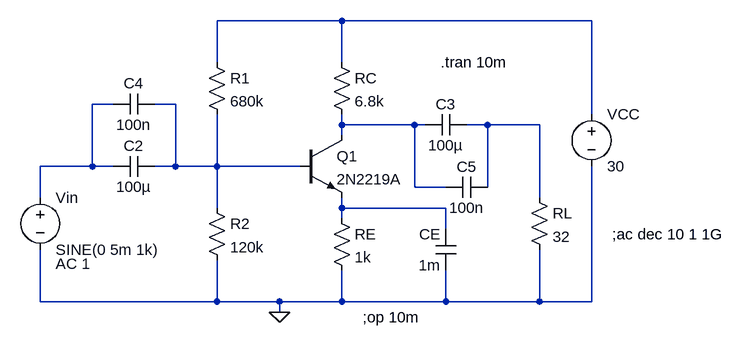
[diagram p0: schematic Circuit 2.asc]
Circuit 2.asc, the LTspice schematic file:
Version 4
SHEET 1 1024 680
WIRE 432 64 240 64
WIRE 816 64 432 64
WIRE 240 128 240 64
WIRE 432 128 432 64
WIRE 80 192 48 192
WIRE 176 192 144 192
WIRE 816 208 816 64
WIRE 432 224 432 208
WIRE 544 224 432 224
WIRE 560 224 544 224
WIRE 656 224 624 224
WIRE 736 224 656 224
WIRE 432 240 432 224
WIRE 48 288 48 192
WIRE 48 288 -32 288
WIRE 80 288 48 288
WIRE 176 288 176 192
WIRE 176 288 144 288
WIRE 240 288 240 208
WIRE 240 288 176 288
WIRE 368 288 240 288
WIRE 544 320 544 224
WIRE 592 320 544 320
WIRE 656 320 656 224
WIRE -32 336 -32 288
WIRE 736 336 736 224
WIRE 240 352 240 288
WIRE 432 352 432 336
WIRE 592 352 432 352
WIRE 432 368 432 352
WIRE 592 384 592 352
WIRE -32 496 -32 416
WIRE 240 496 240 432
WIRE 240 496 -32 496
WIRE 336 496 240 496
WIRE 432 496 432 448
WIRE 432 496 336 496
WIRE 592 496 592 448
WIRE 592 496 432 496
WIRE 736 496 736 416
WIRE 736 496 592 496
WIRE 816 496 816 288
WIRE 816 496 736 496
WIRE 336 512 336 496
FLAG 336 512 0
SYMBOL voltage -32 320 R0
WINDOW 123 24 118 Left 2
SYMATTR Value2 AC 1
SYMATTR InstName Vin
SYMATTR Value SINE(0 5m 1k)
SYMBOL cap 608 448 R180
WINDOW 0 24 56 Left 2
WINDOW 3 24 8 Left 2
SYMATTR InstName CE
SYMATTR Value 1m
SYMBOL cap 80 304 R270
WINDOW 0 32 32 VTop 2
WINDOW 3 0 32 VBottom 2
SYMATTR InstName C2
SYMATTR Value 100µ
SYMBOL cap 560 240 R270
WINDOW 0 32 32 VTop 2
WINDOW 3 0 32 VBottom 2
SYMATTR InstName C3
SYMATTR Value 100µ
SYMBOL cap 80 208 R270
WINDOW 0 32 32 VTop 2
WINDOW 3 0 32 VBottom 2
SYMATTR InstName C4
SYMATTR Value 100n
SYMBOL res 224 112 R0
SYMATTR InstName R1
SYMATTR Value 680k
SYMBOL res 224 336 R0
SYMATTR InstName R2
SYMATTR Value 120k
SYMBOL res 416 352 R0
SYMATTR InstName RE
SYMATTR Value 1k
SYMBOL res 416 112 R0
SYMATTR InstName RC
SYMATTR Value 6.8k
SYMBOL npn 368 240 R0
SYMATTR InstName Q1
SYMATTR Value 2N2219A
SYMBOL cap 656 304 R90
WINDOW 0 0 32 VBottom 2
WINDOW 3 32 32 VTop 2
SYMATTR InstName C5
SYMATTR Value 100n
SYMBOL voltage 816 192 R0
SYMATTR InstName VCC
SYMATTR Value 30
SYMBOL res 720 320 R0
SYMATTR InstName RL
SYMATTR Value 32
TEXT 848 392 Left 2 !;ac dec 10 1 1G
TEXT 464 520 Left 2 !;op 10m
TEXT 584 128 Left 2 !.tran 10m

The netlist it stands for:
* Circuit 2.asc
Vin N002 0 SINE(0 5m 1k) AC 1
CE 0 N006 1m
C2 N002 N003 100µ
C3 N004 N005 100µ
C4 N002 N003 100n
R1 N001 N003 680k
R2 N003 0 120k
RE N006 0 1k
RC N001 N004 6.8k
Q1 N004 N003 N006 0 2N2219A
C5 N005 N004 100n
VCC N001 0 30
RL N005 0 32
.model NPN NPN
.model PNP PNP
.lib standard.bjt
;ac dec 10 1 1G
;op 10m
.tran 10m
.backanno
.end